# Altium project Transmitter power board.PrjPcb
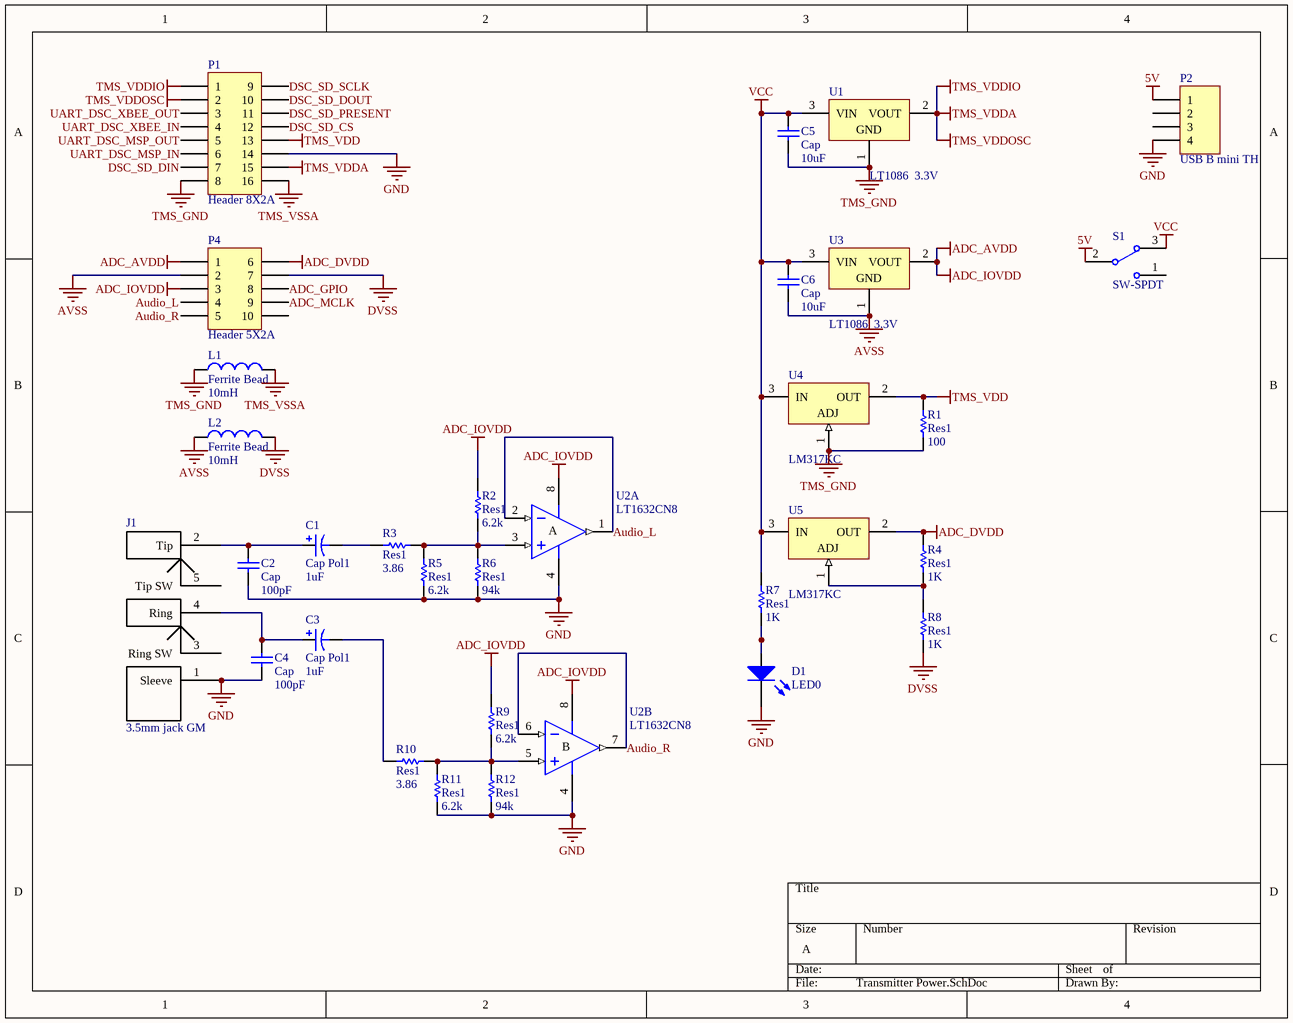
[diagram p0: Transmitter Power.SchDoc]
1 sheet, 31 parts. Net scope: global (net labels, ports and power ports of the same name join across sheets).
Board file: TxPower.PcbDoc

## Sheet Transmitter Power.SchDoc
size A

### Parts
C1  Cap Pol1  value 1uF  [RB7.6-15]
C2  Cap  value 100pF  [RAD-0.3]
C3  Cap Pol1  value 1uF  [RB7.6-15]
C4  Cap  value 100pF  [RAD-0.3]
C5  Cap  value 10uF  [RAD-0.3]
C6  Cap  value 10uF  [RAD-0.3]
D1  LED0  [LED-0]
J1  3.5mm jack GM  [3.5mm jack GM]
L1  Ferrite Bead  value 10mH  [HDR1X2]
L2  Ferrite Bead  value 10mH  [HDR1X2]
P1  Header 8X2A  [HDR2X8_CEN]
P2  USB B mini TH  [USB B mini Molex]
P4  Header 5X2A  [HDR2X5_CEN]
R1  Res1  value 100  [AXIAL-0.3]
R2  Res1  value 6.2k  [AXIAL-0.3]
R3  Res1  value 3.86  [AXIAL-0.3]
R4  Res1  value 1K  [AXIAL-0.3]
R5  Res1  value 6.2k  [AXIAL-0.3]
R6  Res1  value 94k  [AXIAL-0.3]
R7  Res1  value 1K  [AXIAL-0.3]
R8  Res1  value 1K  [AXIAL-0.3]
R9  Res1  value 6.2k  [AXIAL-0.3]
R10  Res1  value 3.86  [AXIAL-0.3]
R11  Res1  value 6.2k  [AXIAL-0.3]
R12  Res1  value 94k  [AXIAL-0.3]
S1  SW-SPDT  [SW DPST jameco]
U1  LT1086  3.3V  [TO-220]
U2  LT1632CN8  [DIP-8]  (parts A,B of 2)
U3  LT1086  3.3V  [TO-220]
U4  LM317KC  [KC03]
U5  LM317KC  [KC03]

### Nets
5V: P2.1 S1.2
ADC_AVDD: P4.1 P4.3 R2.2 R9.2 U2.8(V+) U3.2(VOUT)  [also labelled ADC_IOVDD]
ADC_DVDD: P4.6 R4.2 U5.2(OUT)
AVSS: C6.1 L2.1 P4.2 U3.1(GND)
DVSS: L2.2 P4.7 R8.1
GND: C2.1 C4.1 D1.2(K) J1.1(Sleeve) P1.14 P2.4 R5.1 R6.1 R11.1 R12.1 U2.4(V-)
TMS_GND: C5.1 L1.1 P1.8 R1.1 U1.1(GND) U4.1(ADJ)
TMS_VDD: P1.13 R1.2 U4.2(OUT)
TMS_VDDA: P1.1 P1.2 P1.15 U1.2(VOUT)  [also labelled TMS_VDDIO, TMS_VDDOSC]
TMS_VSSA: L1.2 P1.16
VCC: C5.2 C6.2 R7.2 S1.3 U1.3(VIN) U3.3(VIN) U4.3(IN) U5.3(IN)
ADC_GPIO: P4.8
ADC_MCLK: P4.9
Audio_L: P4.4 U2.1(OUT) U2.2(IN-)
Audio_R: P4.5 U2.6(IN-) U2.7(OUT)
DSC_SD_CS: P1.12
DSC_SD_DIN: P1.7
DSC_SD_DOUT: P1.10
DSC_SD_PRESENT: P1.11
DSC_SD_SCLK: P1.9
UART_DSC_MSP_IN: P1.6
UART_DSC_MSP_OUT: P1.5
UART_DSC_XBEE_IN: P1.4
UART_DSC_XBEE_OUT: P1.3
NetC1_1: C1.1 C2.2 J1.2(Tip)
NetC1_2: C1.2 R3.1
NetC3_1: C3.1 C4.2 J1.4(Ring)
NetC3_2: C3.2 R10.1
NetD1_1: D1.1(A) R7.1
NetR2_1: R2.1 R3.2 R5.2 R6.2 U2.3(IN+)
NetR4_1: R4.1 R8.2 U5.1(ADJ)
NetR9_1: R9.1 R10.2 R11.2 R12.2 U2.5(IN+)

Not connected (* = marked no-connect by the designer): J1 3(Ring_SW) 5(Tip_SW); P2 2 3; P4 10; S1 1

### Notes on the sheet
- (in symbol LT1632CN8, part A) A
- (in symbol LT1632CN8, part B) B

### Library data of the parts
C1 C3 = Cap Pol1: Polarized Capacitor (Radial); Published: 8-Jun-2000; LatestRevisionDate: 17-Jul-2002; LatestRevisionNote: Re-released for DXP Platform.; PackageReference: RB7.6-15; Publisher: Altium Limited; PackageDescription: Polarized Capacitor (Radial); 2 Leads
C2 C4-C6 = Cap: Capacitor; Published: 8-Jun-2000; LatestRevisionDate: 17-Jul-2002; LatestRevisionNote: Re-released for DXP Platform.; PackageReference: RAD-0.3; Publisher: Altium Limited; PackageDescription: Radial Cap, Thru-Hole; 2 Leads; 0.3 in Pin Spacing
D1 = LED0: Typical INFRARED GaAs LED; Published: 8-Jun-2000; LatestRevisionDate: 08-Jul-2005; LatestRevisionNote: Mech Layer 1 removed.; PackageReference: LED-0; Publisher: Altium Limited; PackageDescription: LED; 2 Leads
L1 L2 = Inductor: Code_IEC: 1005; Published: 8-Jun-2000; LatestRevisionDate: 29-May-2009; LatestRevisionNote: IPC-7351 Footprint Added.; PackageReference: 0402-A; Publisher: Altium Limited; PackageDescription: Chip Inductor; Code_JEITA: 0402
P1 = Header 8X2A: Header, 8-Pin, Dual row; LatestRevisionDate: 17-Jul-2002; LatestRevisionNote: Re-released for DXP Platform.; Publisher: Altium Limited
P4 = Header 5X2A: Header, 5-Pin, Dual row; LatestRevisionDate: 17-Jul-2002; LatestRevisionNote: Re-released for DXP Platform.; Publisher: Altium Limited
R1-R12 = Res1: Resistor; Published: 8-Jun-2000; LatestRevisionDate: 17-Jul-2002; LatestRevisionNote: Re-released for DXP Platform.; PackageReference: AXIAL-0.3; Publisher: Altium Limited; PackageDescription: Axial Device, Thru-Hole; 2 Leads; 0.3 in Pin Spacing
S1 = SW-SPDT: SPDT Subminiature Toggle Switch, Right Angle Mounting, Vertical Actuation; Published: 24-Mar-1999; LatestRevisionDate: 17-Dec-2003; LatestRevisionNote: Schematic revised, PCB Footprint replaced.; DatasheetVersion: 05-Dec-2000; PackageReference: TL36WW15050; Publisher: Altium Limited; PackageDescription: Switch; 4 Leads; ComponentLink1Description: Manufacturer Link; ComponentLink1URL: http://www.apem.com
U2 = LT1632CN8: 45MHz, 45V/µs, Dual Rail-to-Rail Input and Output Precision Operational Amplifier; Note: 1455; Published: 8-Jun-2000; LatestRevisionDate: 29-May-2009; LatestRevisionNote: Component Body Added.; DatasheetVersion: 1996; PackageVersion: N8 1002; PackageReference: N8; Publisher: Altium Limited; PackageDescription: DIP, Plastic, 8-Pin, Row Spacing 7.62 mm, Pitch 2.54 mm; ComponentLink1Description: Manufacturer Link; ComponentLink1URL: http://www.linear.com/; ComponentLink2Description: Datasheet; ComponentLink2URL: http://www.linear.com/pc/downloadDocument.do?navId=H0,C1,C1154,C1009,C1022,P1642,D3055
U4 U5 = LM317KC: 3-Terminal Adjustable Regulator; Note: Pin 2 is electrically connected to tab; Published: 15-Apr-2002; DatasheetVersion: Feb-1988; PackageVersion: Sep-1995; PackageReference: KC03; Publisher: Altium Limited; PackageDescription: TO, Thru-Hole, Vertical, Heatsink Mounted; 3 In-Line Leads; Pitch 2.54 mm; ComponentLink1Description: Manufacturer Link; ComponentLink1URL: http://www.ti.com/
P2 = USB B mini TH: LatestRevisionDate: 17-Jul-2002; LatestRevisionNote: Re-released for DXP Platform.; Publisher: Altium Limited; Digikey: WM17115-ND